# Altium schematic sheet USB.SchDoc
size A3; SheetNumber: 5; SheetTotal: 6
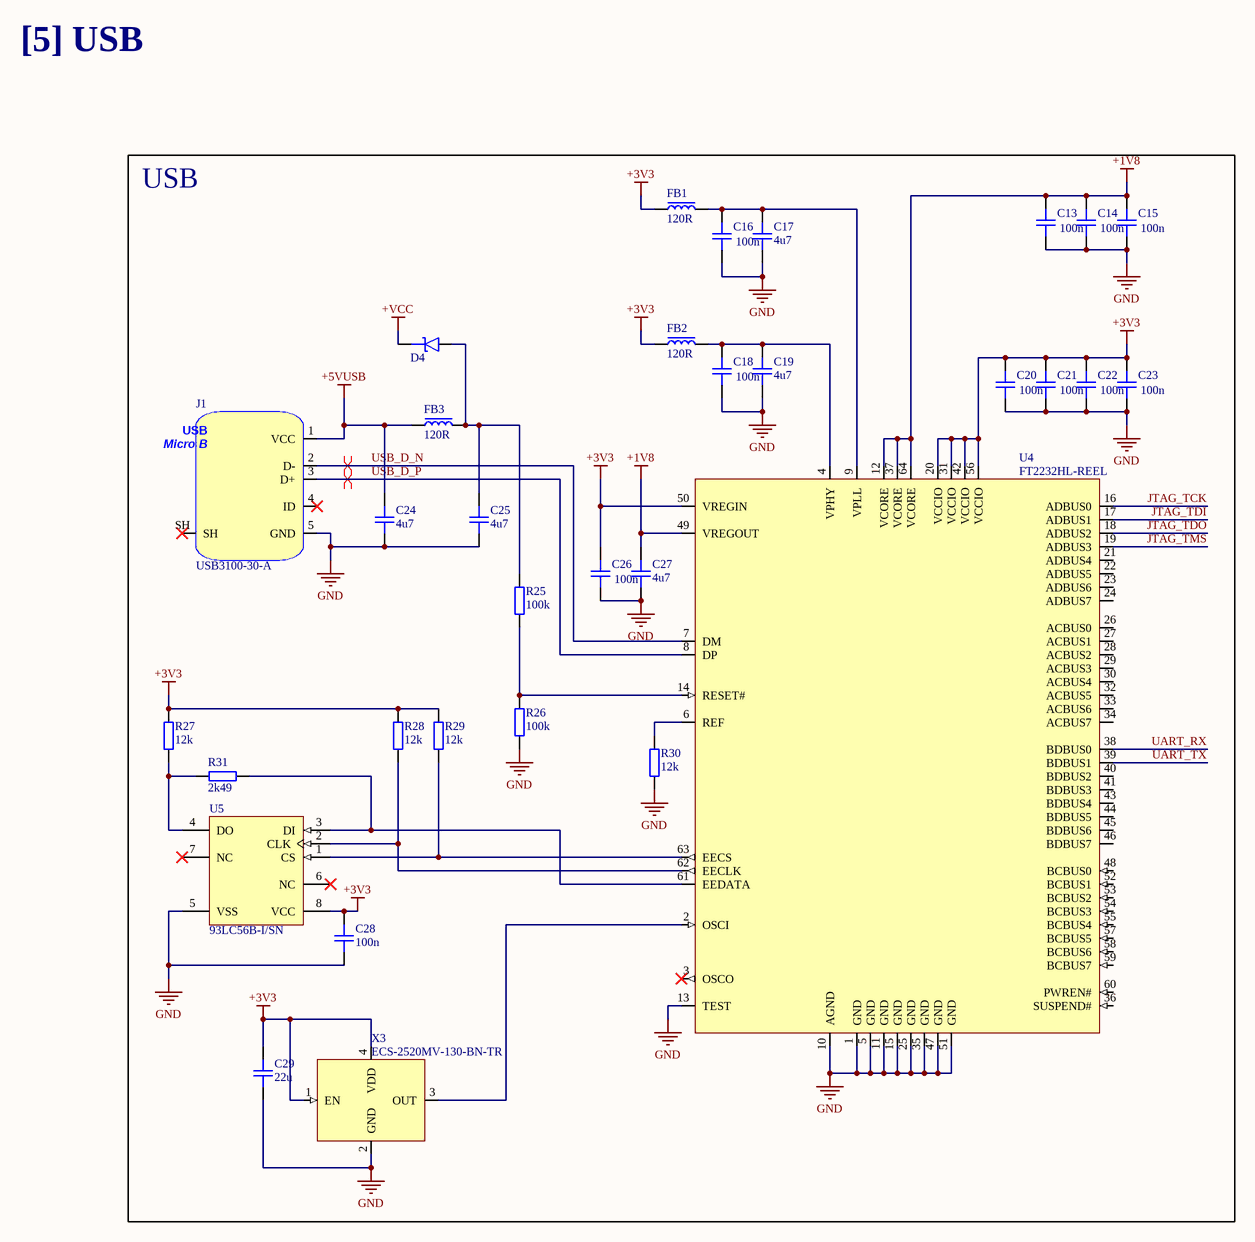
[diagram p0: USB.SchDoc]

## Parts
C13  100n  [CAP_0402]
C14  100n  [CAP_0402]
C15  100n  [CAP_0402]
C16  100n  [CAP_0402]
C17  4u7  [CAP_0402]
C18  100n  [CAP_0402]
C19  4u7  [CAP_0402]
C20  100n  [CAP_0402]
C21  100n  [CAP_0402]
C22  100n  [CAP_0402]
C23  100n  [CAP_0402]
C24  4u7  [CAP_0402]
C25  4u7  [CAP_0402]
C26  100n  [CAP_0402]
C27  4u7  [CAP_0402]
C28  100n  [CAP_0402]
C29  22u  [CAP_0402]
D4  D_SCHOTTKY_SMC  [SMC-DO-214AB]  (value not drawn)
FB1  120R  [FB_0402]
FB2  120R  [FB_0402]
FB3  120R  [FB_0402]
J1  USB3100-30-A  [USB3100-30-A]
R25  100k  [RES_0603]
R26  100k  [RES_0603]
R27  12k  [RES_0402]
R28  12k  [RES_0402]
R29  12k  [RES_0402]
R30  12k  [RES_0402]
R31  2k49  [RES_0402]
U4  FT2232HL-REEL  [LQFP-64-0.5mm]
U5  93LC56B-I/SN  [SOIC-SN8_L]
X3  ECS-2520MV-130-BN-TR  [XTAL_2520]

## Blocks framed on the sheet
USB: C13-C29 D4 FB1-FB3 J1 R25-R31 U4 U5 X3

## Nets
+1V8: C13.2 C14.2 C15.2 C27.2 U4.12(VCORE) U4.37(VCORE) U4.49(VREGOUT) U4.64(VCORE)
+3V3: C20.2 C21.2 C22.2 C23.2 C26.2 C28.2 C29.2 FB1.1 FB2.1 R27.2 R28.2 R29.2 U4.20(VCCIO) U4.31(VCCIO) U4.42(VCCIO) U4.50(VREGIN) U4.56(VCCIO) U5.8(VCC) X3.1(EN) X3.4(VDD)
+5VUSB: C24.2 FB3.1 J1.1(VCC)
+VCC: D4.K
GND: C13.1 C14.1 C15.1 C16.1 C17.1 C18.1 C19.1 C20.1 C21.1 C22.1 C23.1 C24.1 C25.1 C26.1 C27.1 C28.1 C29.1 J1.5(GND) R26.1 R30.1 U4.1(GND) U4.5(GND) U4.10(AGND) U4.11(GND) U4.13(TEST) U4.15(GND) U4.25(GND) U4.35(GND) U4.47(GND) U4.51(GND) U5.5(VSS) X3.2(GND)
JTAG_TCK: U4.16(ADBUS0)
JTAG_TDI: U4.17(ADBUS1)
JTAG_TDO: U4.18(ADBUS2)
JTAG_TMS: U4.19(ADBUS3)
UART_RX: U4.38(BDBUS0)
UART_TX: U4.39(BDBUS1)
USB_D_N: J1.2(D-) U4.7(DM)
USB_D_P: J1.3(D+) U4.8(DP)
NetC16_2: C16.2 C17.2 FB1.2 U4.9(VPLL)
NetC18_2: C18.2 C19.2 FB2.2 U4.4(VPHY)
NetC25_2: C25.2 D4.A FB3.2 R25.2
NetR25_1: R25.1 R26.2 U4.14(RESET#)
NetR27_1: R27.1 R31.2 U5.4(DO)
NetR28_1: R28.1 U4.62(EECLK) U5.2(CLK)
NetR29_1: R29.1 U4.63(EECS) U5.1(CS)
NetR30_2: R30.2 U4.6(REF)
NetR31_1: R31.1 U4.61(EEDATA) U5.3(DI)
NetU4_2: U4.2(OSCI) X3.3(OUT)

Not connected (* = marked no-connect by the designer): J1 4(ID)* SH*; U4 3(OSCO)* 21(ADBUS4) 22(ADBUS5) 23(ADBUS6) 24(ADBUS7) 26(ACBUS0) 27(ACBUS1) 28(ACBUS2) 29(ACBUS3) 30(ACBUS4) 32(ACBUS5) 33(ACBUS6) 34(ACBUS7) 36(SUSPEND#) 40(BDBUS2) 41(BDBUS3) 43(BDBUS4) 44(BDBUS5) 45(BDBUS6) 46(BDBUS7) 48(BCBUS0) 52(BCBUS1) 53(BCBUS2) 54(BCBUS3) 55(BCBUS4) 57(BCBUS5) 58(BCBUS6) 59(BCBUS7) 60(PWREN#); U5 6(NC)* 7(NC)*

## Layout directives
differential pair: USB_D_N, USB_D_P

## Notes on the sheet
- [5] USB
- (in symbol USB3100-30-A) USB; Micro B

## Library data of the parts
C13-C29 = CAP_0402: Capacitor SMD 0402; Manufacturer: *; Manufacturer Part Number: *; Distributor Link: *; LCSC: *; Rating: *; Dielectric: *
D4 = D_SCHOTTKY_SMC: Diode Schottky SMD SMC (DO-214AB); Distributor Link: *
FB1-FB3 = FB_0402: Ferrite Bead SMD 0402; Manufacturer: *; Manufacturer Part Number: *; Distributor Link: *; LCSC: *
J1 = USB3100-30-A: USB Connector Type Micro B 2.0 SMD Reverse Mount; Manufacturer: GCT; Manufacturer Part Number: USB3100-30-A
R25 R26 = RES_0603: Resistor SMD 0603; Manufacturer: *; Manufacturer Part Number: *; Distributor Link: *; LCSC: *
R27-R31 = RES_0402: Resistor SMD 0402; Manufacturer: *; Manufacturer Part Number: *; Distributor Link: *; LCSC: *
U4 = FT2232HL-REEL: Hi-Speed Dual USB UART/FIFO IC; Manufacturer: FTDI; Manufacturer Part Number: FT2232HL-REEL; Distributor Link: https://www.mouser.de/ProductDetail/FTDI/FT2232HL-REEL?qs=D1%2FPMqvA100v7FHcEx164g%3D%3D; LCSC: C27882
U5 = CMP-0162-00077-1: 2K, 128x16-bit, 2.5V Microwire Serial EEPROM, 8-Pin SOIC 150mil, Industrial Temperature; Code_IPC: SOIC127P600-8; PackageVersion: revBB, Aug-2009; PackageDescription: 8-Lead Plastic Small Outline (SN) - Narrow, 3.90mm Body [SOIC]; DatasheetVersion: revF, May-2008; PackageReference: SOIC-SN8; Code_JEDEC: MS-012
X3 = ECS-2520MV-130-BN-TR: Standard Clock Oscillators XO (Standard),13MHz,Standby (Power Down),CMOS, Multi-Volt,1.6 V 3.6 V,+/-50ppm,-40 C 85 C,6mA,Surface Mount,4-SMD, No Lead,(2.50mm x 2.00mm),(0.80mm); Manufacturer: ECS; Manufacturer Part Number: ECS-2520MV-130-BN-TR